# EAGLE design neopixel_cab_lights (EAGLE 7.5.0)
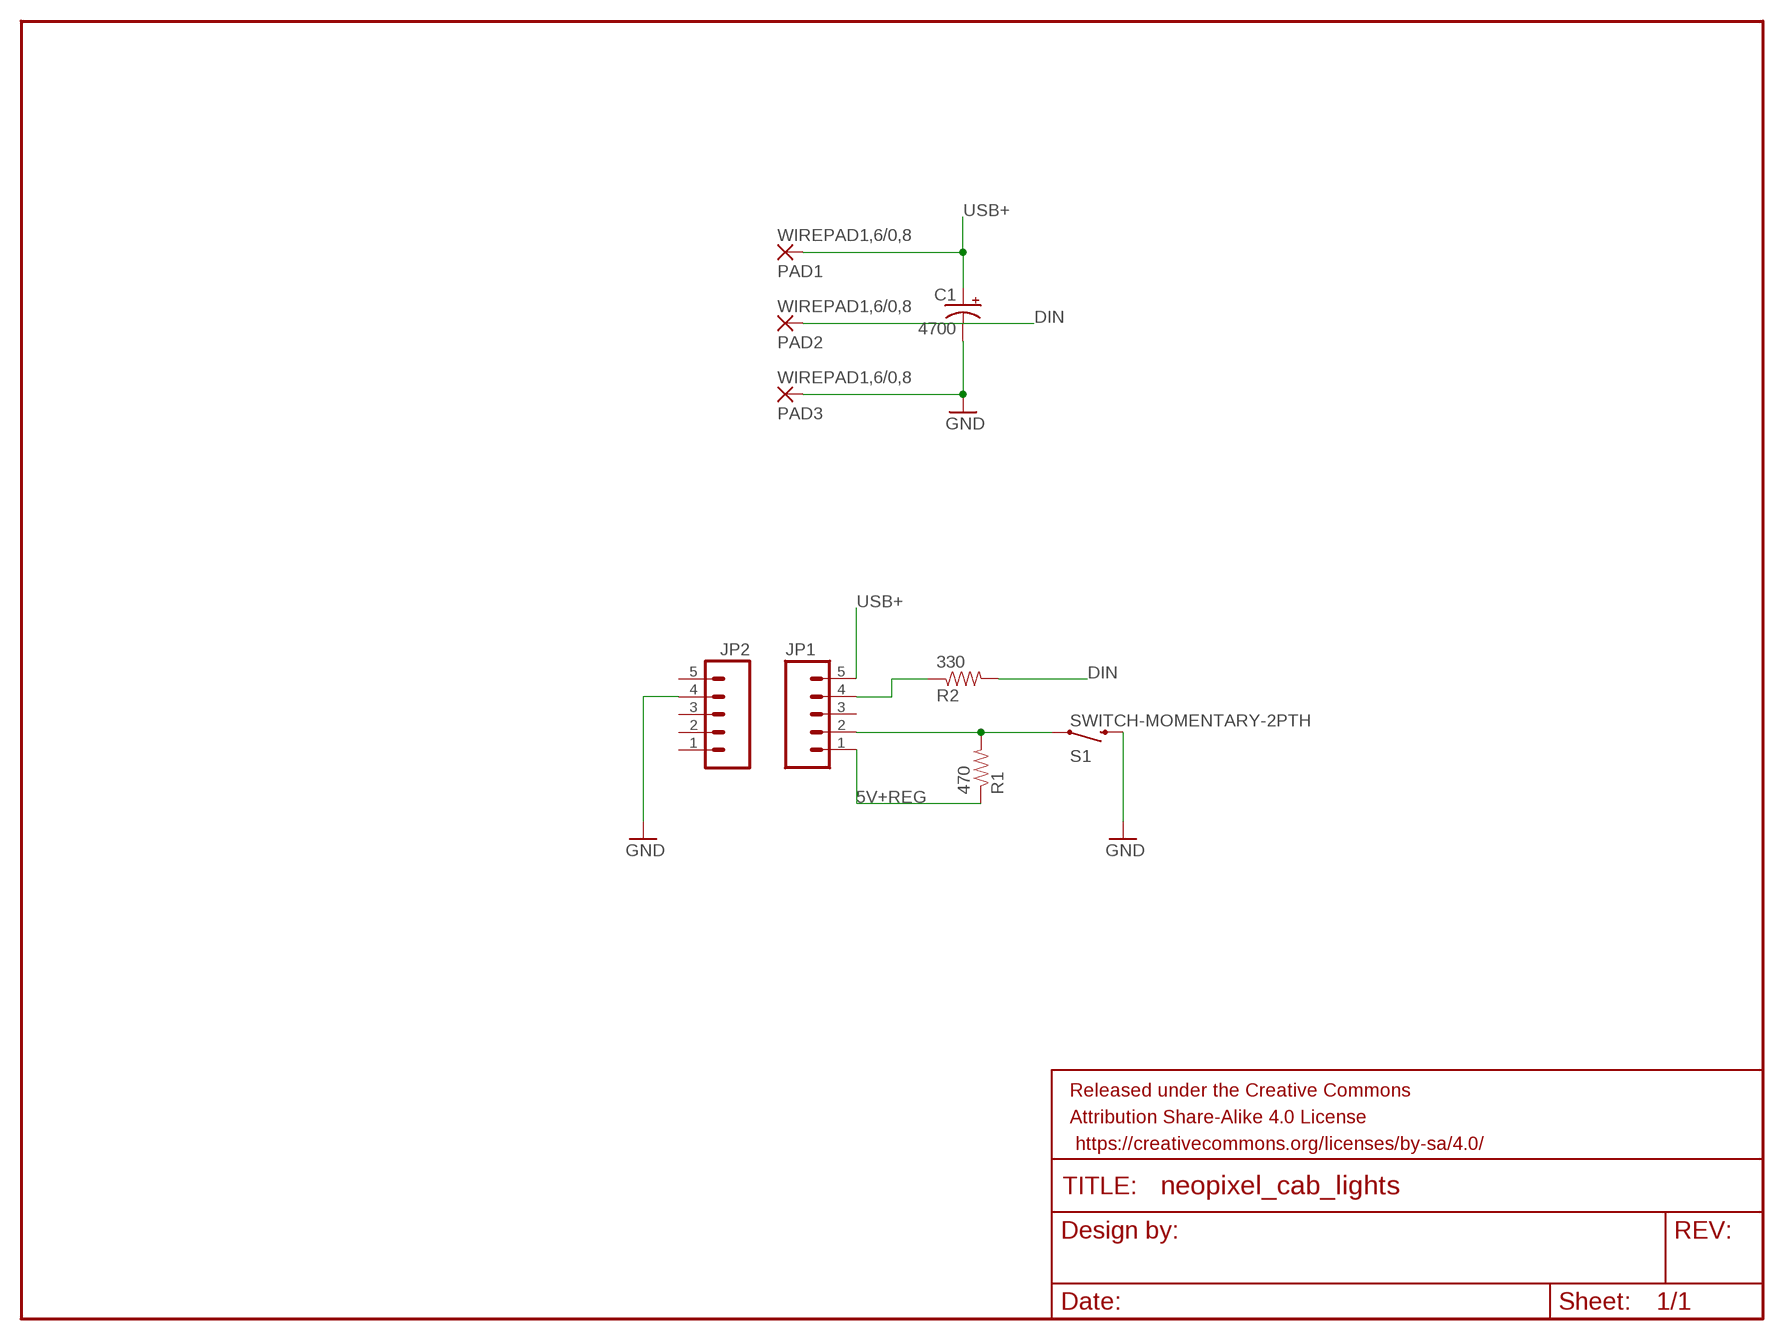
[diagram p0: schematic, sheet 1]

## Parts
C1  4700  CAP_POLPTH1  [CPOL-RADIAL-100UF-25V]
FRAME1  FRAME-LETTERNO_PACKAGE  [DUMMY]
JP1  M05PTH  [1X05]
JP2  M05PTH  [1X05]
PAD1  WIREPAD1,6/0,8  [1,6/0,8]
PAD2  WIREPAD1,6/0,8  [1,6/0,8]
PAD3  WIREPAD1,6/0,8  [1,6/0,8]
R1  470  RESISTORPTH-1/4W  [AXIAL-0.4]
R2  330  RESISTORPTH-1/4W  [AXIAL-0.4]
S1  SWITCH-MOMENTARY-2PTH  [TACTILE-PTH]

## Nets
5V+REG: JP1.1 R1.P$1
DIN: PAD2.1(P) R2.P$2
GND: C1.2(-) JP2.4 PAD3.1(P) S1.3
N$2: JP1.2 R1.P$2 S1.1
N$4: JP1.4 R2.P$1
USB+: C1.1(+) JP1.5 PAD1.1(P)
Unconnected: JP1.3 JP2.1 JP2.2 JP2.3 JP2.5

## Library data of the parts
C1 = SparkFun-Capacitors:CAP_POL: Capacitor Polarized These are standard SMD and PTH capacitors. Normally 10uF, 47uF, and 100uF in electrolytic and tantalum varieties. Always verify the external diameter of the through hole cap, it varies with capacity, voltage, and manufacturer. The EIA devices should be standard.
FRAME1 = SparkFun-Aesthetics:FRAME-LETTER: Schematic Frame Standard 8.5x11 US Letter frame; DESIGNER: Nobody; VERSION: v01
JP1 JP2 = SparkFun-Connectors:M05: Header 5 Standard 5-pin 0.1" header. Use with straight break away headers (SKU : PRT-00116), right angle break away headers (PRT-00553), swiss pins (PRT-00743), machine pins (PRT-00117), and female headers (PRT-00115). Molex polarized connector foot print use with SKU : PRT-08230 with associated crimp pins and housings.
PAD1-PAD3 = wirepad:WIREPAD: Wire PAD connect wire on PCB
R1 R2 = SparkFun-Resistors:RESISTOR: Resistor Basic schematic elements and footprints for 0603, 1206, and PTH resistors.
S1 = SparkFun-Electromechanical:SWITCH-MOMENTARY-2: Various NO switches- pushbuttons, reed, etc; PROD_ID: SWCH-08441

## Board
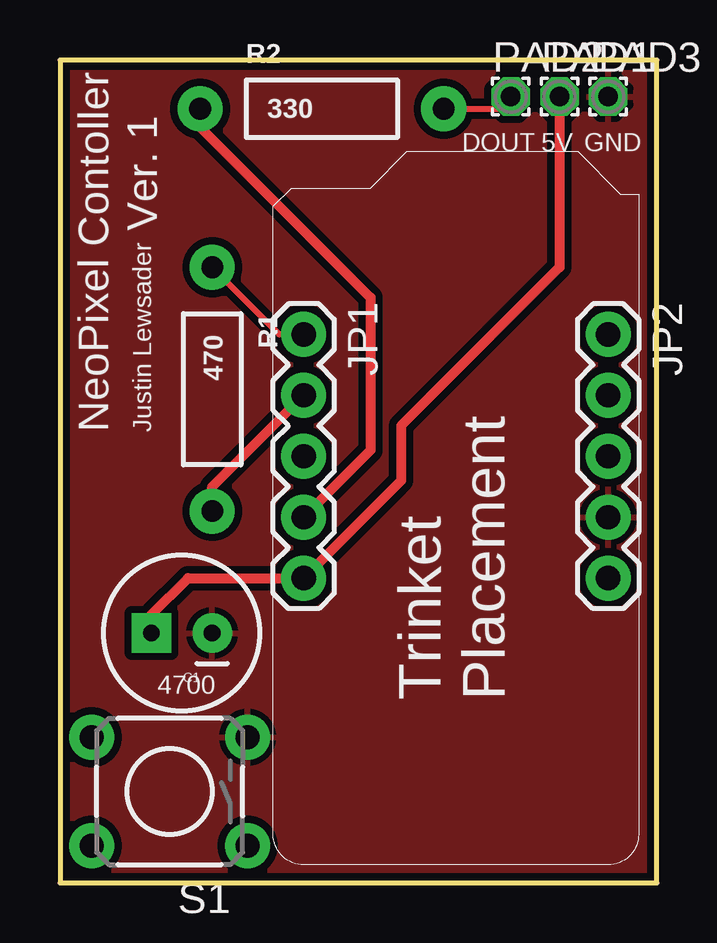
[diagram p1: board, top side]
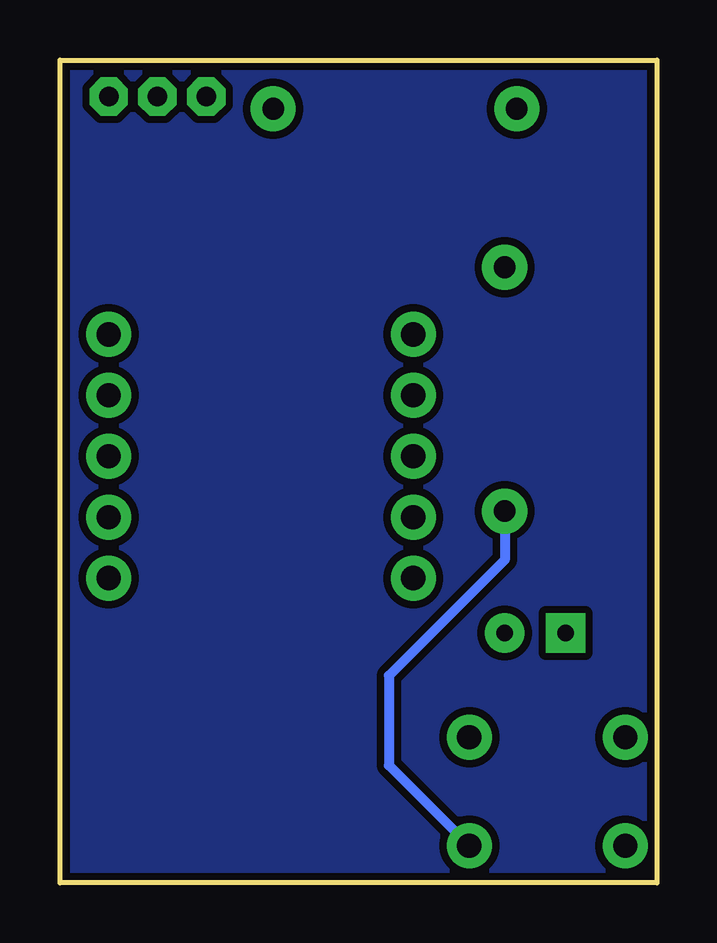
[diagram p2: board, bottom side, seen from below]

Size 24.89 x 34.29 mm. Coordinates in mm from the lower left corner, seen from the top.
Outline: 0,0 24.89,0 24.89,34.29 0,34.29 0,0
Copper layers (1*16): Top 0.035mm / dielectric 1.5mm / Bottom 0.035mm
Design rules "SparkFun-2-layer-STANDARD": minimum track width 10mil, minimum drill 20mil, track to track 10mil, track to pad 8mil, pad to pad 8mil, via to via 10mil, smd to smd 8mil, copper to edge 8mil, drill to drill 8mil, minimum pad ring 10mil, minimum via ring 10mil, stop-mask expansion 4mil, vias tented up to drill 20mil, thermal gap 10mil

### Footprints (pad centres in the part's own frame; a part is rotated, then mirrored left to right if it is on the bottom)
CPOL-RADIAL-100UF-25V = drill 0.7 pad 1.651 square: 1 1.27,0 | drill 0.7 pad 1.651: 2 -1.27,0
1X05 = drill 1.016 pad 1.88: 1 0,0; 2 2.54,0; 3 5.08,0; 4 7.62,0; 5 10.16,0
1,6/0,8 = drill 0.813 pad 1.6 octagon: 1 0,0
AXIAL-0.4 = drill 0.9 pad 1.88: P$1 -5.08,0; P$2 5.08,0
TACTILE-PTH = drill 1.016 pad 1.88: 1 -3.251,2.261; 2 3.251,2.261; 3 -3.251,-2.261; 4 3.251,-2.261

### Placement (x,y rotation side)
C1  5.08,10.41 180 top
FRAME1  -26.67,32.26 0 top  (outside the outline)
JP1  10.16,22.86 270 top
JP2  22.86,22.86 270 top
PAD1  20.83,32.77 0 top
PAD2  18.8,32.77 0 top
PAD3  22.86,32.77 0 top
R1  6.35,20.57 270 top
R2  10.92,32.26 0 top
S1  4.57,3.81 180 top

### Tracks (layer width: path | path; a pad name or v marks a point on that pad's centre or on a via)
5V+REG
  Top 0.254: JP1.1 9.14,22.86 R1.P$1
DIN
  Top 0.254: R2.P$2 18.29,32.26 PAD2.1
GND
  pour Top (isolate 0.305): 0,0.51 0,33.78 24.89,33.78 24.89,0.51
N$1
  pour Bottom (isolate 0.305): 0,0.51 0,33.78 24.89,33.78 24.89,0.51
N$2
  Top 0.406: R1.P$2 6.35,16.51 JP1.2
  Bottom 0.406: R1.P$2 6.35,13.46 11.18,8.64 11.18,4.9 S1.1
N$4
  Top 0.406: R2.P$1 5.84,31.5 12.95,24.38 12.95,18.03 JP1.4
USB+
  Top 0.406: PAD1.1 20.83,25.65 14.22,19.05 14.22,16.76 JP1.5 5.33,12.7 3.81,11.18 C1.1

### Text on the board
tPlace: DOUT | 5V | GND | Ver. 1 | NeoPixel Contoller | Justin Lewsader | 4700 | Trinket / Placement